# EAGLE schematic simple-differential-power-supply-rev1 (EAGLE 9.2.2)

## Sheet 1 of 3
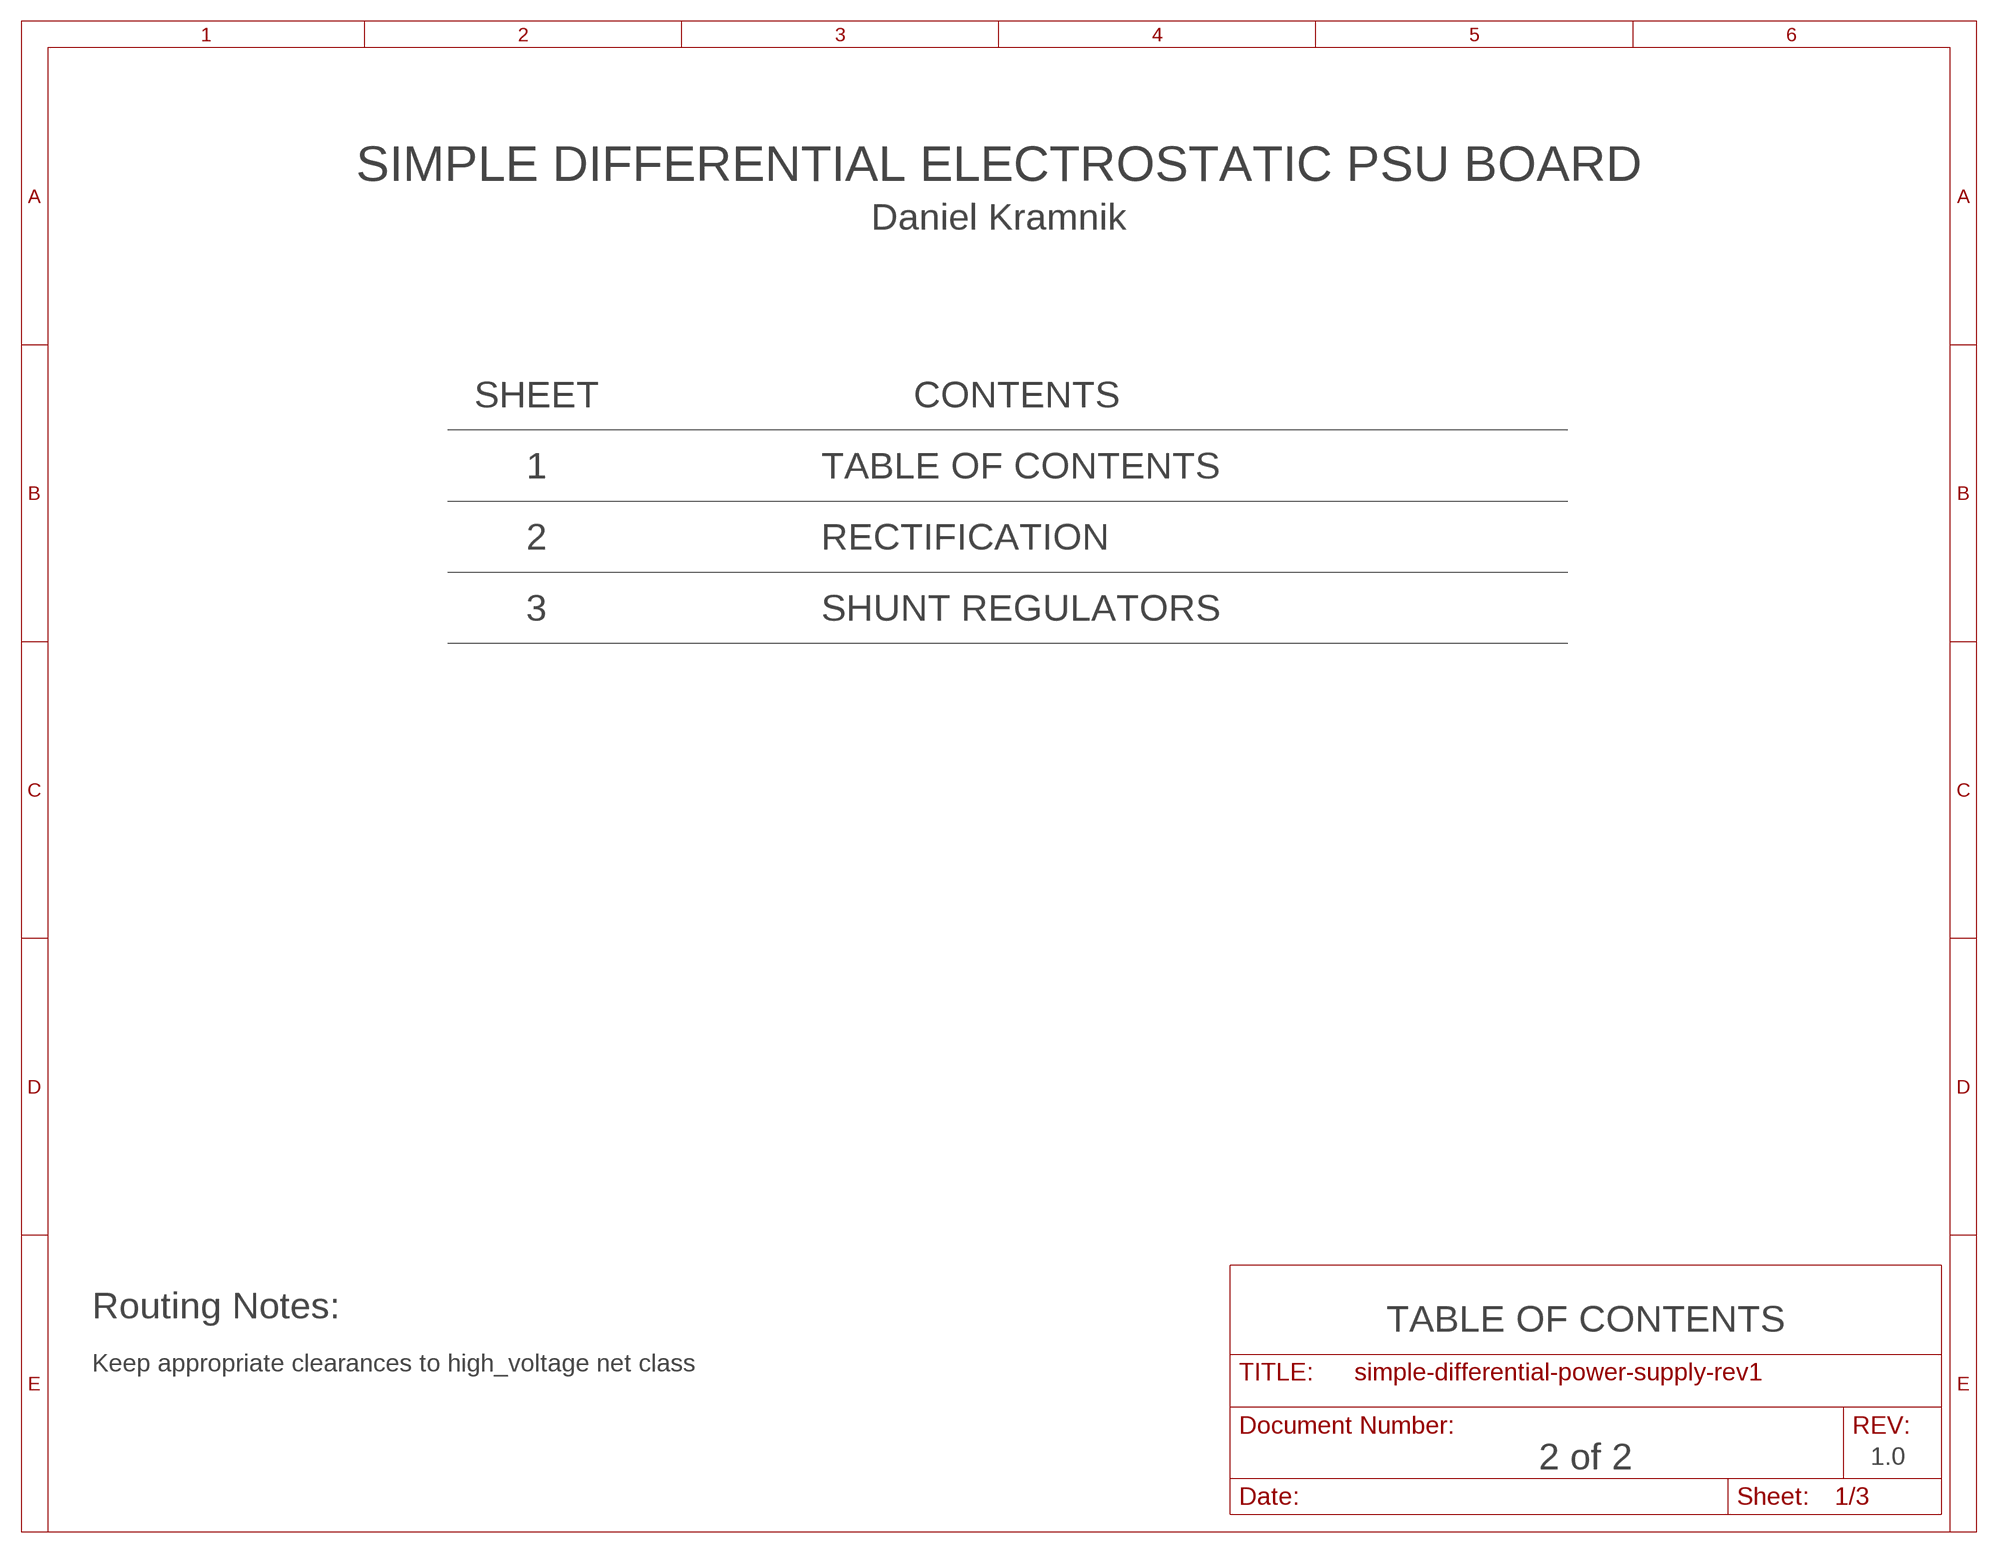
[diagram p0: schematic, sheet 1]

### Notes on the sheet
- SIMPLE DIFFERENTIAL ELECTROSTATIC PSU BOARD
- Daniel Kramnik
- SHEET | CONTENTS
- 1 | TABLE OF CONTENTS
- 2 | RECTIFICATION
- 3 | SHUNT REGULATORS
- Routing Notes: | TABLE OF CONTENTS
- Keep appropriate clearances to high_voltage net class
- 2 of 2 | 1.0

## Sheet 2 of 3
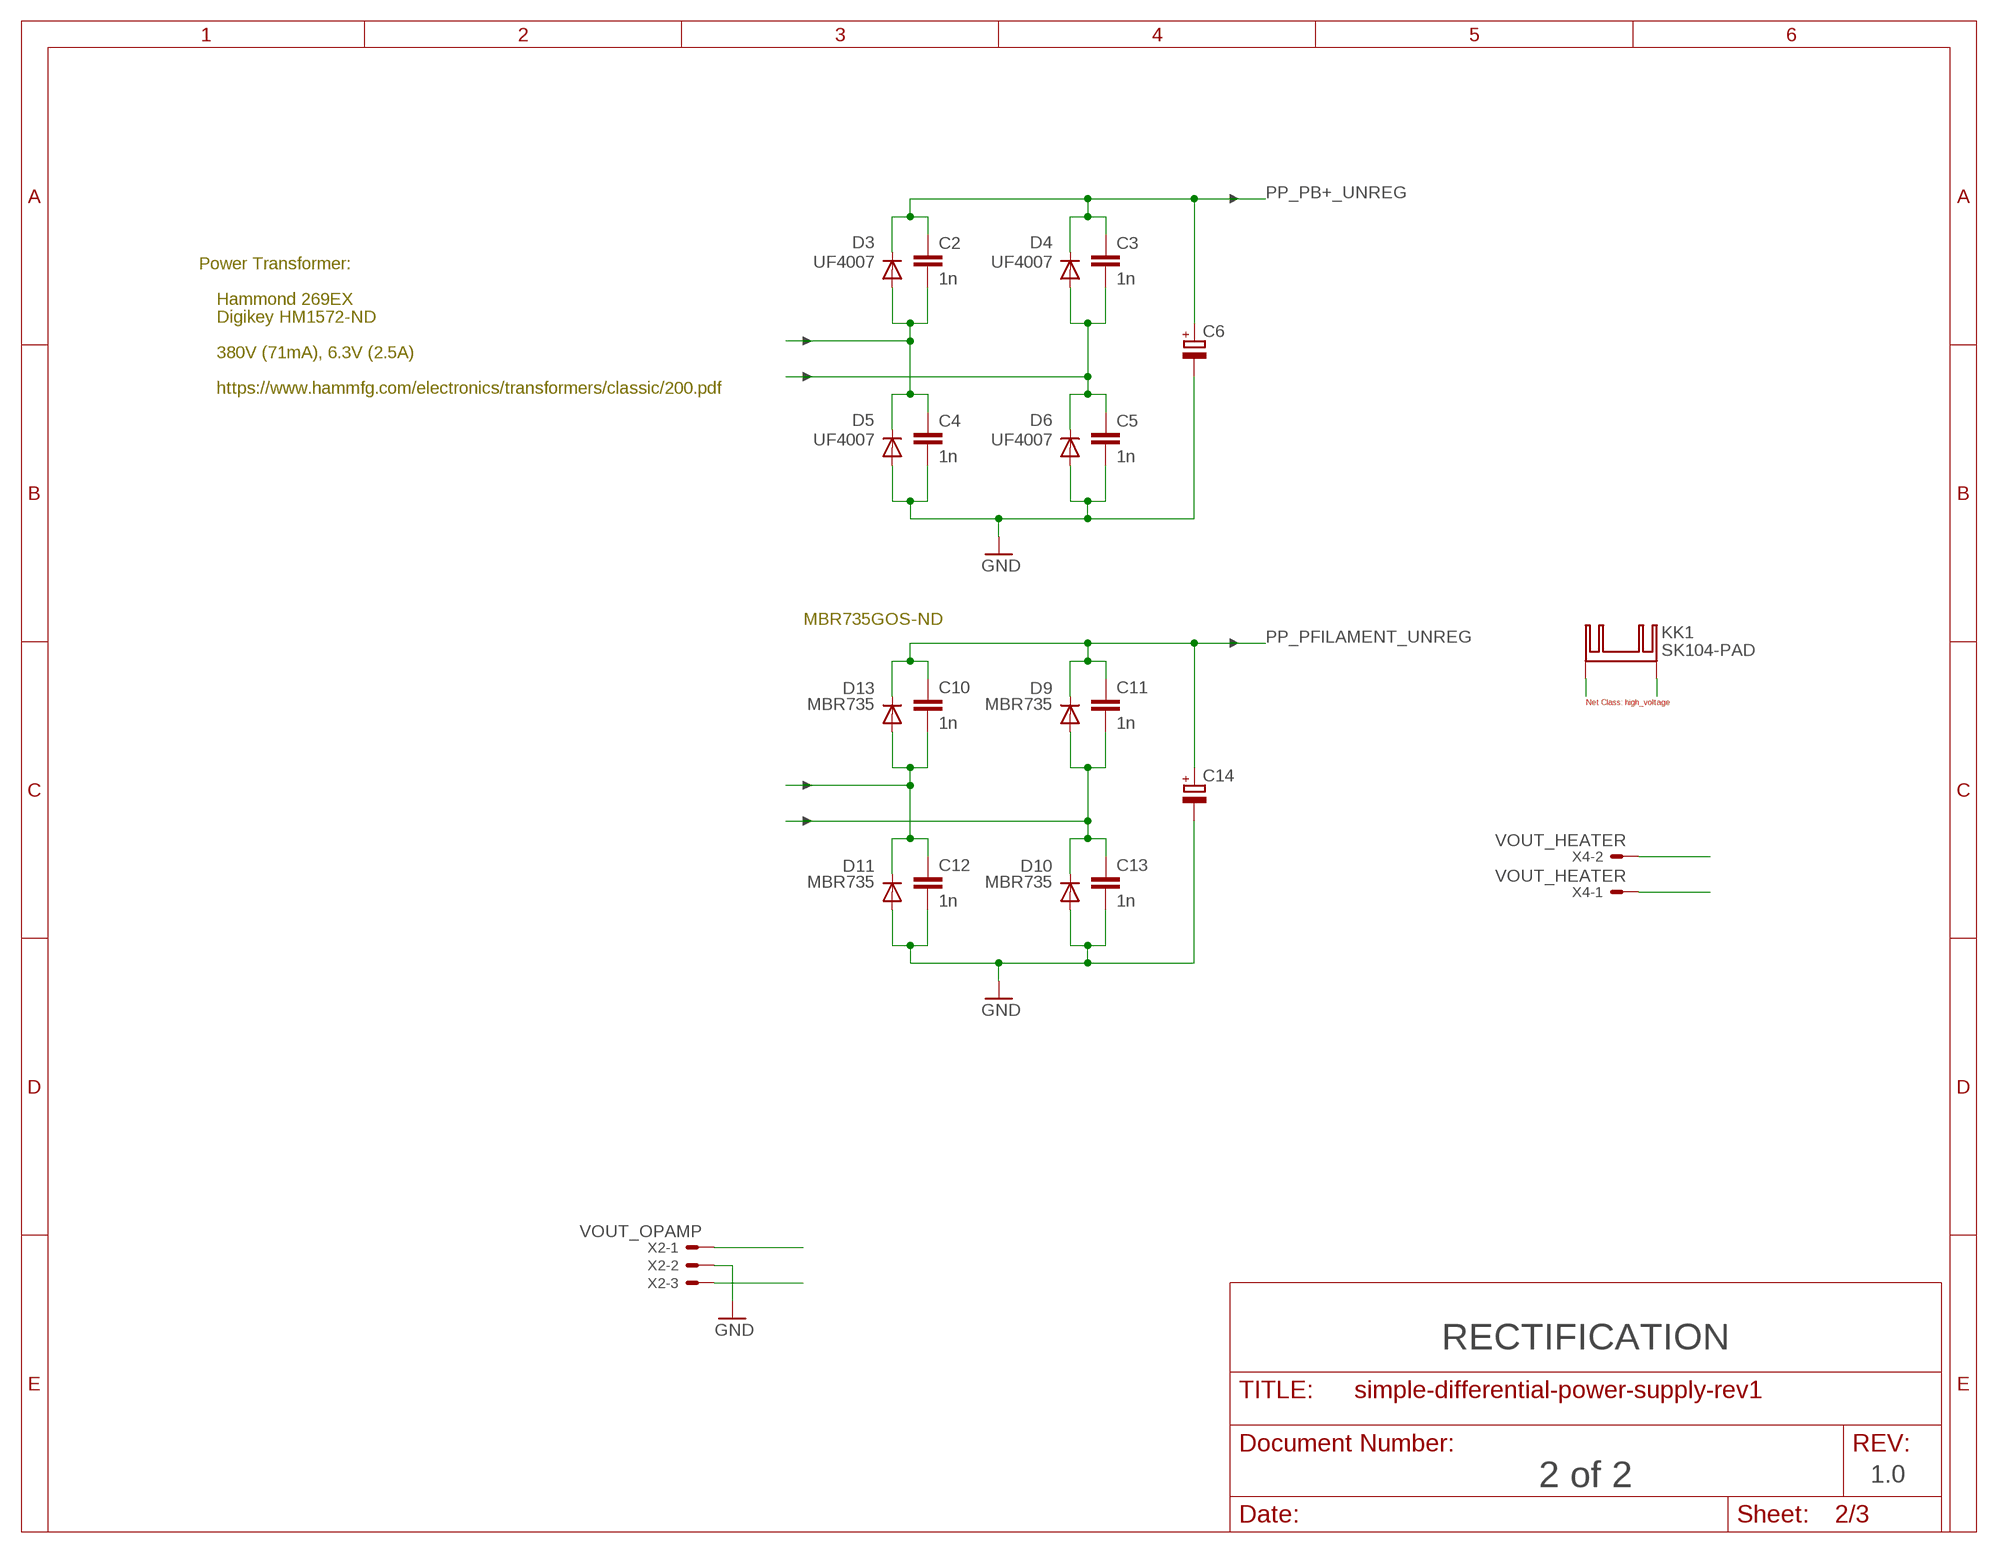
[diagram p1: schematic, sheet 2]

### Parts
C2  1n  C-EU225-087X268  [C225-087X268]
C3  1n  C-EU225-087X268  [C225-087X268]
C4  1n  C-EU225-087X268  [C225-087X268]
C5  1n  C-EU225-087X268  [C225-087X268]
C6  CPOL-EUE10-25  [EB25D]
C10  1n  C-EU225-087X268  [C225-087X268]
C11  1n  C-EU225-087X268  [C225-087X268]
C12  1n  C-EU225-087X268  [C225-087X268]
C13  1n  C-EU225-087X268  [C225-087X268]
C14  CPOL-EUE10-25  [EB25D]
D3  UF4007  1N4004  [DO41-10]
D4  UF4007  1N4004  [DO41-10]
D5  UF4007  1N4004  [DO41-10]
D6  UF4007  1N4004  [DO41-10]
D9  MBR735  DIODE-TO220V  [TO220ACS]
D10  MBR735  DIODE-TO220V  [TO220ACS]
D11  MBR735  DIODE-TO220V  [TO220ACS]
D13  MBR735  DIODE-TO220V  [TO220ACS]
KK1  SK104-PAD  [SK104-PAD]
X2  VOUT_OPAMP  KK-156-3  [KK-156-3]
X4  VOUT_HEATER  KK-156-2  [KK-156-2]

### Nets
GND: C4.2 C5.2 C6.- C12.2 C13.2 C14.- D5.A D6.A D10.A D11.A X2.2 ; also sheet 3
N$1: C11.2 C13.1 D9.A D10.C
N$2: C10.2 C12.1 D11.C D13.A
N$11: C3.2 C5.1 D4.A D6.C
N$12: C2.2 C4.1 D3.A D5.C
N$16 [high_voltage]: KK1.K2(K)
N$17: X2.3
N$18: X2.1
N$19: X4.2
N$20: X4.1
PP_PB+_UNREG: C2.1 C3.1 C6.+ D3.C D4.C ; also sheet 3
PP_PFILAMENT_UNREG: C10.1 C11.1 C14.+ D9.C D13.C
Unconnected: KK1.K1(K)

### Notes on the sheet
- Power Transformer:
- Hammond 269EX
- Digikey HM1572-ND
- 380V (71mA), 6.3V (2.5A)
- https://www.hammfg.com/electronics/transformers/classic/200.pdf
- MBR735GOS-ND
- Net Class: high_voltage
- RECTIFICATION
- 2 of 2 | 1.0

## Sheet 3 of 3
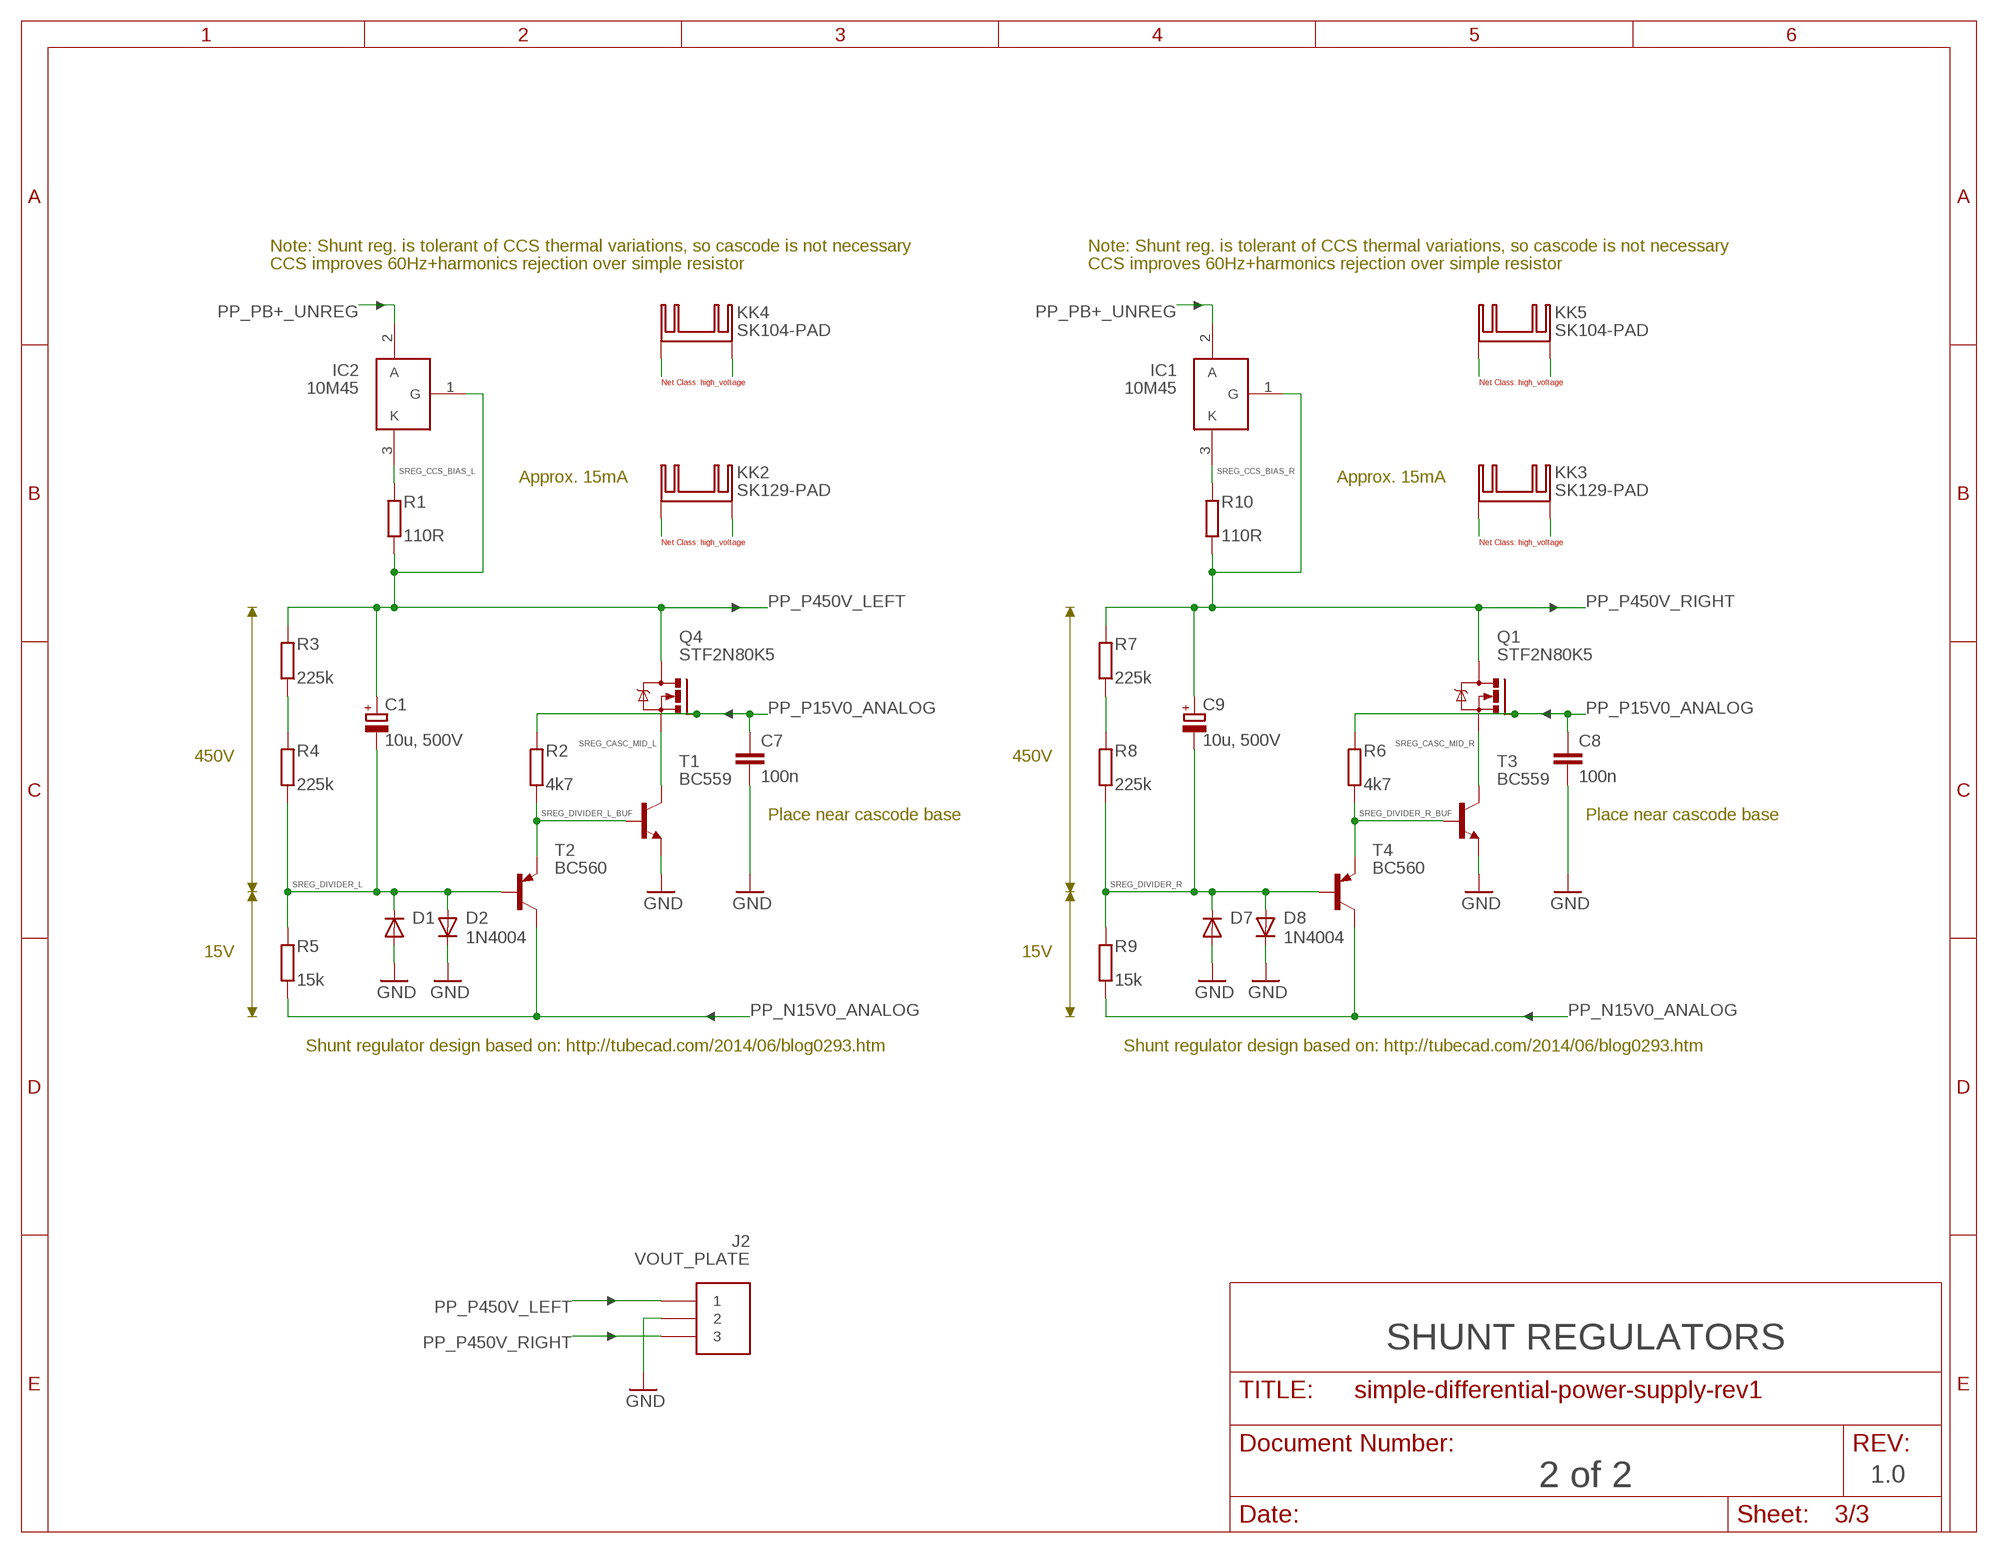
[diagram p2: schematic, sheet 3]

### Parts
C1  10u, 500V  CPOL-EUE10-25  [EB25D]
C7  100n  C-EU050-025X075  [C050-025X075]
C8  100n  C-EU050-025X075  [C050-025X075]
C9  10u, 500V  CPOL-EUE10-25  [EB25D]
D1  1N4004  [DO41-10]
D2  1N4004  [DO41-10]
D7  1N4004  [DO41-10]
D8  1N4004  [DO41-10]
IC1  10M45  10M45V  [TO220V]
IC2  10M45  10M45V  [TO220V]
J2  VOUT_PLATE  CONN_MOLEX_3PIN_MINI-FIT_JR  [CONN_MOLEX_3PIN_MINI-FIT_JR]
KK2  SK129-PAD  [SK129]
KK3  SK129-PAD  [SK129]
KK4  SK104-PAD  [SK104-PAD]
KK5  SK104-PAD  [SK104-PAD]
Q1  STF2N80K5  IRF540  [TO220BV]
Q4  STF2N80K5  IRF540  [TO220BV]
R1  110R  R-EU_0309/10  [0309/10]
R2  4k7  R-EU_0309/10  [0309/10]
R3  225k  R-EU_0309/10  [0309/10]
R4  225k  R-EU_0309/10  [0309/10]
R5  15k  R-EU_0309/10  [0309/10]
R6  4k7  R-EU_0309/10  [0309/10]
R7  225k  R-EU_0309/10  [0309/10]
R8  225k  R-EU_0309/10  [0309/10]
R9  15k  R-EU_0309/10  [0309/10]
R10  110R  R-EU_0309/10  [0309/10]
T1  BC559  2N5088-NPN-TO92-EBC  [TO92-EBC]
T2  BC560  2N5087-PNP-TO92-EBC  [TO92-EBC]
T3  BC559  2N5088-NPN-TO92-EBC  [TO92-EBC]
T4  BC560  2N5087-PNP-TO92-EBC  [TO92-EBC]

### Nets
GND: C7.2 C8.2 D1.A D2.C D7.A D8.C J2.2 T1.E T3.E ; also sheet 2
N$3 [high_voltage]: KK4.K1(K)
N$4: R3.1 R4.2
N$5 [high_voltage]: KK4.K2(K)
N$6 [high_voltage]: KK2.A2,5(K)
N$7: R7.1 R8.2
N$8 [high_voltage]: KK2.B2,5(K)
N$9 [high_voltage]: KK5.K1(K)
N$10 [high_voltage]: KK5.K2(K)
N$13 [high_voltage]: KK3.A2,5(K)
N$14 [high_voltage]: KK3.B2,5(K)
PP_N15V0_ANALOG: R5.1 R9.1 T2.C T4.C
PP_P15V0_ANALOG: C7.1 C8.1 Q1.G Q4.G R2.2 R6.2
PP_P450V_LEFT: C1.+ IC2.1(G) J2.1 Q4.D R1.1 R3.2
PP_P450V_RIGHT: C9.+ IC1.1(G) J2.3 Q1.D R7.2 R10.1
PP_PB+_UNREG: IC1.2(A) IC2.2(A) ; also sheet 2
SREG_CASC_MID_L: Q4.S T1.C
SREG_CASC_MID_R: Q1.S T3.C
SREG_CCS_BIAS_L: IC2.3(K) R1.2
SREG_CCS_BIAS_R: IC1.3(K) R10.2
SREG_DIVIDER_L: C1.- D1.C D2.A R4.1 R5.2 T2.B
SREG_DIVIDER_L_BUF: R2.1 T1.B T2.E
SREG_DIVIDER_R: C9.- D7.C D8.A R8.1 R9.2 T4.B
SREG_DIVIDER_R_BUF: R6.1 T3.B T4.E

### Notes on the sheet
- Note: Shunt reg. is tolerant of CCS thermal variations, so cascode is not necessary | Note: Shunt reg. is tolerant of CCS thermal variations, so cascode is not necessary
- CCS improves 60Hz+harmonics rejection over simple resistor | CCS improves 60Hz+harmonics rejection over simple resistor
- Net Class: high_voltage | Net Class: high_voltage
- Approx. 15mA | Approx. 15mA
- Net Class: high_voltage | Net Class: high_voltage
- 450V | 450V
- Place near cascode base | Place near cascode base
- 15V | 15V
- Shunt regulator design based on: http://tubecad.com/2014/06/blog0293.htm | Shunt regulator design based on: http://tubecad.com/2014/06/blog0293.htm
- SHUNT REGULATORS
- 2 of 2 | 1.0

## Library data of the parts
C1 C6 C9 C14 = rcl:CPOL-EU: POLARIZED CAPACITOR, European symbol
C2-C5 C7 C8 C10-C13 = rcl:C-EU: CAPACITOR, European symbol
D1-D8 = diode:1N4004: DIODE general purpose rectifier, 1 A
D9-D11 D13 = diode:DIODE-: DIODE
IC1 IC2 = Kramnik's Library:10M45: 10M45 CCS IC
J2 = Kramnik's Library:CONN_MOLEX_3PIN_MINI-FIT_JR; VALUE: MOLEX_0039302031
KK1 KK4 KK5 = heatsink:SK104-PAD: HEATSINK manufacturer Fischer/distributor Buerklin
KK2 KK3 = heatsink:SK129-PAD: HEATSINK manufacturer Fischer/distributor Buerklin
Q1 Q4 = Kramnik's Library:IRF540: HEXFET Power MOSFET
R1-R10 = rcl:R-EU_: RESISTOR, European symbol
T1 T3 = transistor-neu-to92:*-NPN-: NPN Transistror
T2 T4 = transistor-neu-to92:*-PNP-: PNP Transistror
X2 = con-molex:KK-156-3: KK 156 HEADER Source: http://www.molex.com/pdm_docs/sd/026604100_sd.pdf; OC_FARNELL: unknown; OC_NEWARK: unknown
X4 = con-molex:KK-156-2: KK 156 HEADER Source: http://www.molex.com/pdm_docs/sd/026604100_sd.pdf; OC_FARNELL: unknown; OC_NEWARK: unknown

## Net classes
1 high_voltage: width 1.422 mm, clearance 1.422 mm